# EAGLE design zif_breakout (EAGLE 9.6.2)
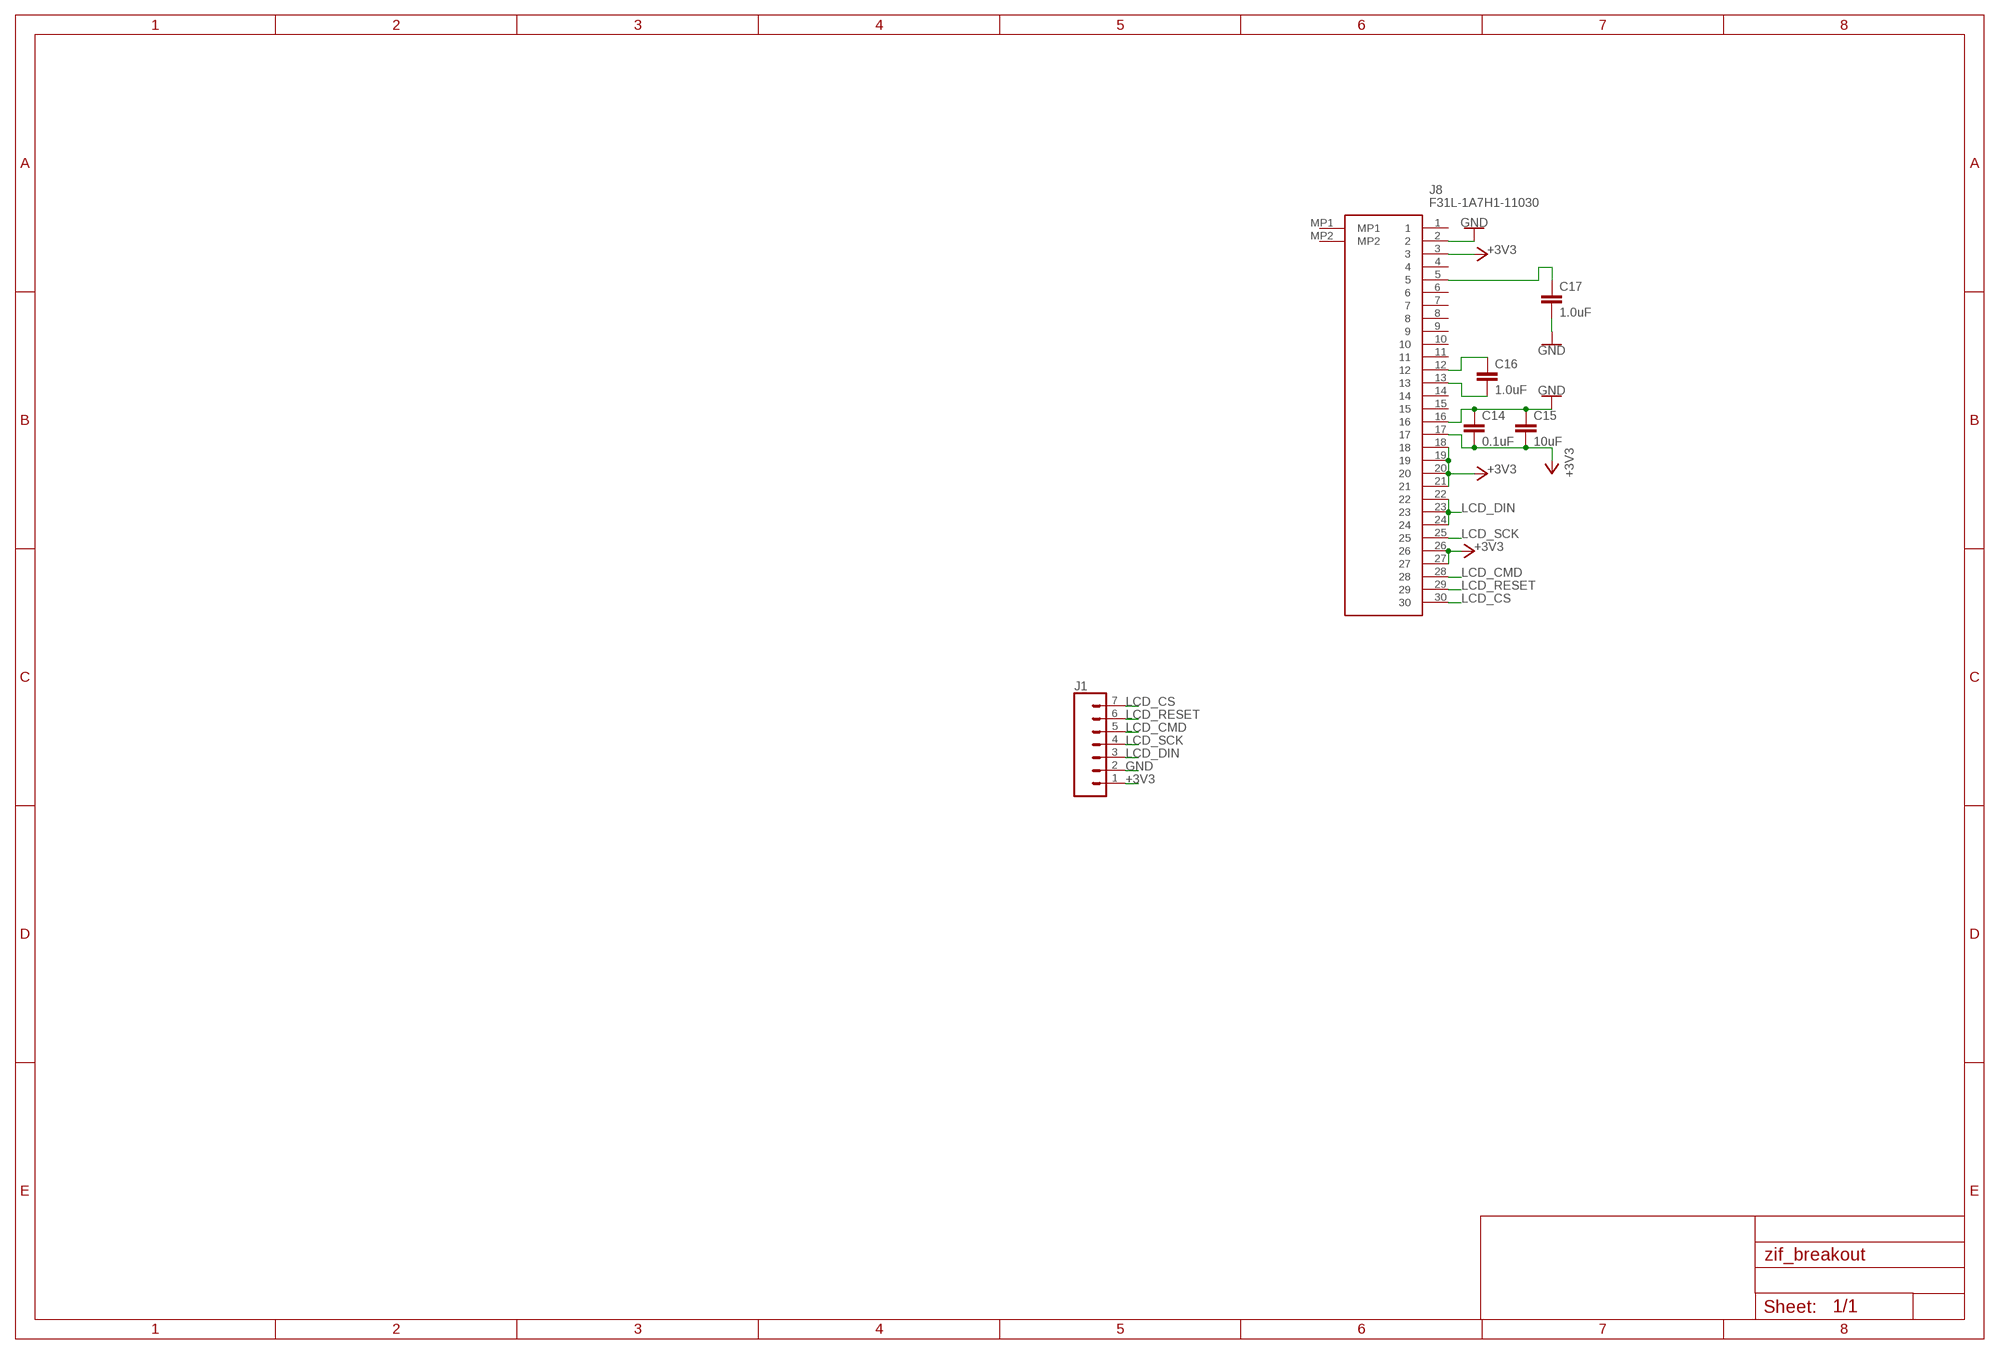
[diagram p0: schematic, sheet 1]

## Parts
C14  0.1uF  0.1UF-0603-25V-(+80/-20%)  [0603]
C15  10uF  10UF-0603-6.3V-20%  [0603]
C16  1.0uF  1.0UF-0603-16V-10%  [0603]
C17  1.0uF  1.0UF-0603-16V-10%  [0603]
J1  CONN_07  [1X07]
J8  F31L-1A7H1-11030  [F31L1A7H111030]

## Nets
+3V3: C14.2 C15.2 J1.1 J8.3 J8.17 J8.18 J8.19 J8.20 J8.21 J8.26 J8.27
GND: C14.1 C15.1 C17.2 J1.2 J8.2 J8.16
LCD_CMD: J1.5 J8.28
LCD_CS: J1.7 J8.30
LCD_DIN: J1.3 J8.22 J8.23 J8.24
LCD_RESET: J1.6 J8.29
LCD_SCK: J1.4 J8.25
N$3: C17.1 J8.5
N$12: C16.2 J8.13
N$13: C16.1 J8.12
Unconnected: J8.1 J8.4 J8.6 J8.7 J8.8 J8.9 J8.10 J8.11 J8.14 J8.15 J8.MP1 J8.MP2

## Library data of the parts
C14 = SparkFun-Capacitors:0.1UF: 0.1µF ceramic capacitors A capacitor is a passive two-terminal electrical component used to store electrical energy temporarily in an electric field.; PROD_ID: CAP-00810
C15 = SparkFun-Capacitors:10UF: 10.0µF ceramic capacitors A capacitor is a passive two-terminal electrical component used to store electrical energy temporarily in an electric field.; PROD_ID: CAP-11015
C16 C17 = SparkFun-Capacitors:1.0UF: 1µF ceramic capacitors A capacitor is a passive two-terminal electrical component used to store electrical energy temporarily in an electric field.; PROD_ID: CAP-00868
J1 = SparkFun-Connectors:CONN_07: Multi connection point. Often used as Generic Header-pin footprint for 0.1 inch spaced/style header connections On any of the 0.1 inch spaced packages, you can populate with these: Break Away Headers - Straight <https://www.sparkfun.com/products/116> (PRT-00116) Break Away Male Headers - Right Angle <https://www.sparkfun.com/products/553> (PRT-00553) Female Headers <https://www.sparkfun.com/products/115> (PRT-00115) Break Away Headers - Machine Pin <https://www.sparkfun.com/products/117> (PRT-00117) Break Away Female Headers - Swiss Machine Pin <https://www.sparkfun.com/products/743> (PRT-00743) For SCREWTERMINALS and SPRING TERMINALS visit here: Screw Terimnals on SparkFun.com <https://www.sparkfun.com/search/results?term=Screw+Terminals> (5mm/3.5mm/2.54mm spacing) This device is also useful as a general connection point to wire up your design to another part of your project. Our various solder wires solder well into these plated through hole pads. Hook-Up Wire - Assortment (Stranded, 22 AWG) <https://www.sparkfun.com/products/11375> (PRT-11375) Hook-Up Wire - Assortment (Solid Core, 22 AWG) <https://www.sparkfun.com/products/11367> (PRT-11367) View the entire wire category on our website here <https://www.sparkfun.com/categories/141> Special notes: Molex polarized connector foot print use with SKU : PRT-08231 with associated crimp pins and housings. 1MM SMD Version SKU: PRT-10208 NOTES ON THE VARIANTS LOCK and LOCK_LONGPADS... This footprint was designed to help hold the alignment of a through-hole component (i.e. 6-pin header) while soldering it into place. You may notice that each hole has been shifted either up or down by 0.005 of an inch from it's more standard position (which is a perfectly straight line). This slight alteration caused the pins (the squares in the middle) to touch the edges of the holes. Because they are alternating, it causes a "brace" to hold the component in place. 0.005 has proven to be the perfect amount of "off-center" position when using our standard breakaway headers. Although looks a little odd when you look at the bare footprint, once you have a header in there, the alteration is very hard to notice. Also,if you push a header all the way into place, it is covered up entirely on the bottom side.
J8 = F31L-1A7H1-11030:F31L-1A7H1-11030: Flex Connector, 0.50mm Pitch, Height 2.55mm, Right angle, Flip type, ZIF, 30 position , With MYLAR Source: Datasheet <https://cdn.amphenol-cs.com/media/wysiwyg/files/drawing/a-s0099-lf31l.pdf>; DESCRIPTION: Flex Connector, 0.50mm Pitch, Height 2.55mm, Right angle, Flip type, ZIF, 30 position , With MYLAR; HEIGHT: 2.75mm; MANUFACTURER_NAME: Amphenol; MANUFACTURER_PART_NUMBER: F31L-1A7H1-11030; MOUSER_PART_NUMBER: 649-F31L-1A7H1-11030; MOUSER_PRICE-STOCK: https://www.mouser.co.uk/ProductDetail/Amphenol-Aorora/F31L-1A7H1-11030?qs=xZ%2FP%252Ba9zWqba3JhFjnTbQA%3D%3D

## Board
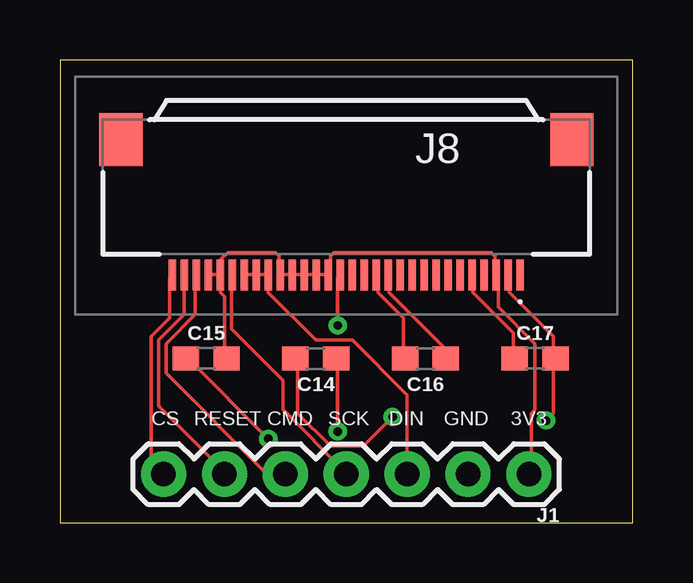
[diagram p1: board, top side]
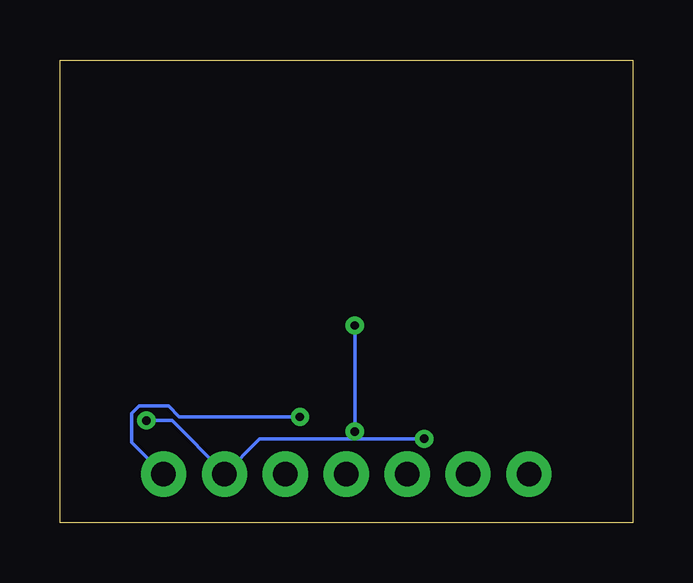
[diagram p2: board, bottom side, seen from below]

Size 23.88 x 19.3 mm. Coordinates in mm from the lower left corner, seen from the top.
Outline: 0,0 23.88,0 23.88,19.3 0,19.3 0,0
Copper layers (1*16): Top 0.035mm / dielectric 1.5mm / Bottom 0.035mm
Design rules "default": minimum track width 6mil, minimum drill 0.35mm, track to track 6mil, track to pad 6mil, pad to pad 6mil, via to via 6mil, smd to smd 6mil, copper to edge 40mil, drill to drill 6mil, minimum pad ring 10mil, minimum via ring 8mil, stop-mask expansion 4mil, vias tented up to drill 0mil, thermal gap 10mil

### Footprints (pad centres in the part's own frame; a part is rotated, then mirrored left to right if it is on the bottom)
0603 = smd 1.1 x 1: 1 -0.85,0; 2 0.85,0
1X07 = drill 1.016 pad 1.88: 1 0,0; 2 2.54,0; 3 5.08,0; 4 7.62,0; 5 10.16,0; 6 12.7,0; 7 15.24,0
F31L1A7H111030 = smd 0.3 x 1.3: 1 -7.25,3.64; 2 -6.75,3.64; 3 -6.25,3.64; 4 -5.75,3.64; 5 -5.25,3.64; 6 -4.75,3.64; 7 -4.25,3.64; 8 -3.75,3.64; 9 -3.25,3.64; 10 -2.75,3.64; 11 -2.25,3.64; 12 -1.75,3.64; 13 -1.25,3.64; 14 -0.75,3.64; 15 -0.25,3.64; 16 0.25,3.64; 17 0.75,3.64; 18 1.25,3.64; 19 1.75,3.64; 20 2.25,3.64; 21 2.75,3.64; 22 3.25,3.64; 23 3.75,3.64; 24 4.25,3.64; 25 4.75,3.64; 26 5.25,3.64; 27 5.75,3.64; 28 6.25,3.64; 29 6.75,3.64; 30 7.25,3.64 | smd 1.8 x 2.2: MP1 -9.4,-2.01; MP2 9.4,-2.01

### Placement (x,y rotation side)
C14  10.67,6.86 180 top
C15  6.1,6.86 0 top
C16  15.24,6.86 180 top
C17  19.81,6.86 0 top
J1  19.56,2.03 180 top
J8  11.94,13.97 180 top

### Tracks (layer width: path | path; a pad name or v marks a point on that pad's centre or on a via)
+3V3  (via drill 0.35)
  Top 0.152: C15.2 6.86,6.86 6.86,9.45 6.71,9.6 6.71,10.21 J8.26 | J8.27 6.25,10.36 6.55,10.36 J8.26 | J8.26 6.71,10.36 6.71,10.97 7.01,11.28 8.99,11.28 9.14,11.12 9.14,10.36 J8.21 9.3,10.36 9.6,10.36 J8.20 9.75,10.36 10.06,10.36 J8.19 10.21,10.36 10.67,10.36 J8.18 10.82,10.36 11.12,10.36 J8.17 11.28,10.36 11.28,11.12 11.43,11.28 17.98,11.28 18.14,11.12 18.14,10.36 J8.3 18.29,10.21 18.29,8.99 19.81,7.47 19.81,4.72 19.66,4.57 19.66,2.13 J1.1 | v13.87,4.42 12.65,3.2 11.28,3.2 9.91,4.57 9.91,6.86 C14.2
  Bottom 0.152: v13.87,4.42 18.9,4.42 19.36,4.88 20.57,4.88 20.88,4.57 20.88,3.35 J1.1
GND  (via drill 0.35)
  Top 0.152: 20.57,6.86 20.57,7.77 18.75,9.6 18.75,10.21 J8.2 | v8.69,3.5 5.33,6.86 C15.1 | v11.58,3.81 11.58,6.86 C14.1 | v11.58,8.23 11.58,10.21 J8.16 | 20.57,6.86 20.57,4.57 v20.27,4.27 | 20.57,6.86 C17.2
  Bottom 0.152: 11.58,3.5 15.54,3.5 J1.2 17.07,2.13 19.2,4.27 v20.27,4.27 | 11.58,3.5 v8.69,3.5 | 11.58,3.5 v11.58,3.81 v11.58,8.23
LCD_CMD
  Top 0.152: J8.28 5.64,10.21 5.64,8.69 4.42,7.47 4.42,6.25 8.53,2.13 9.3,2.13 J1.5
LCD_CS
  Top 0.152: J8.30 4.57,10.21 4.57,8.53 3.81,7.77 3.81,2.59 4.27,2.13 J1.7
LCD_DIN
  Top 0.152: J8.24 7.77,10.36 8.08,10.36 J8.23 8.23,10.36 8.69,10.36 J8.22 8.69,10.21 8.69,9.6 10.67,7.62 12.19,7.62 14.48,5.33 J1.3
LCD_RESET
  Top 0.152: J8.29 5.18,10.21 5.18,8.69 4.12,7.62 4.12,4.88 6.86,2.13 J1.6
LCD_SCK
  Top 0.152: J8.25 7.16,10.21 7.16,8.08 9.3,5.94 9.3,4.72 11.89,2.13 J1.4
N$3
  Top 0.152: C17.1 18.9,6.86 18.9,7.92 17.22,9.6 17.22,10.21 J8.5
N$12
  Top 0.152: C16.2 14.33,6.86 14.33,8.53 13.26,9.6 13.26,10.21 J8.13
N$13
  Top 0.152: C16.1 16,6.86 16,7.32 13.72,9.6 13.72,10.21 J8.12

### Text on the board
tNames: CS | RESET | CMD | SCK | DIN | GND | 3V3